# EAGLE design CAT-897-F (EAGLE 7.7.0)
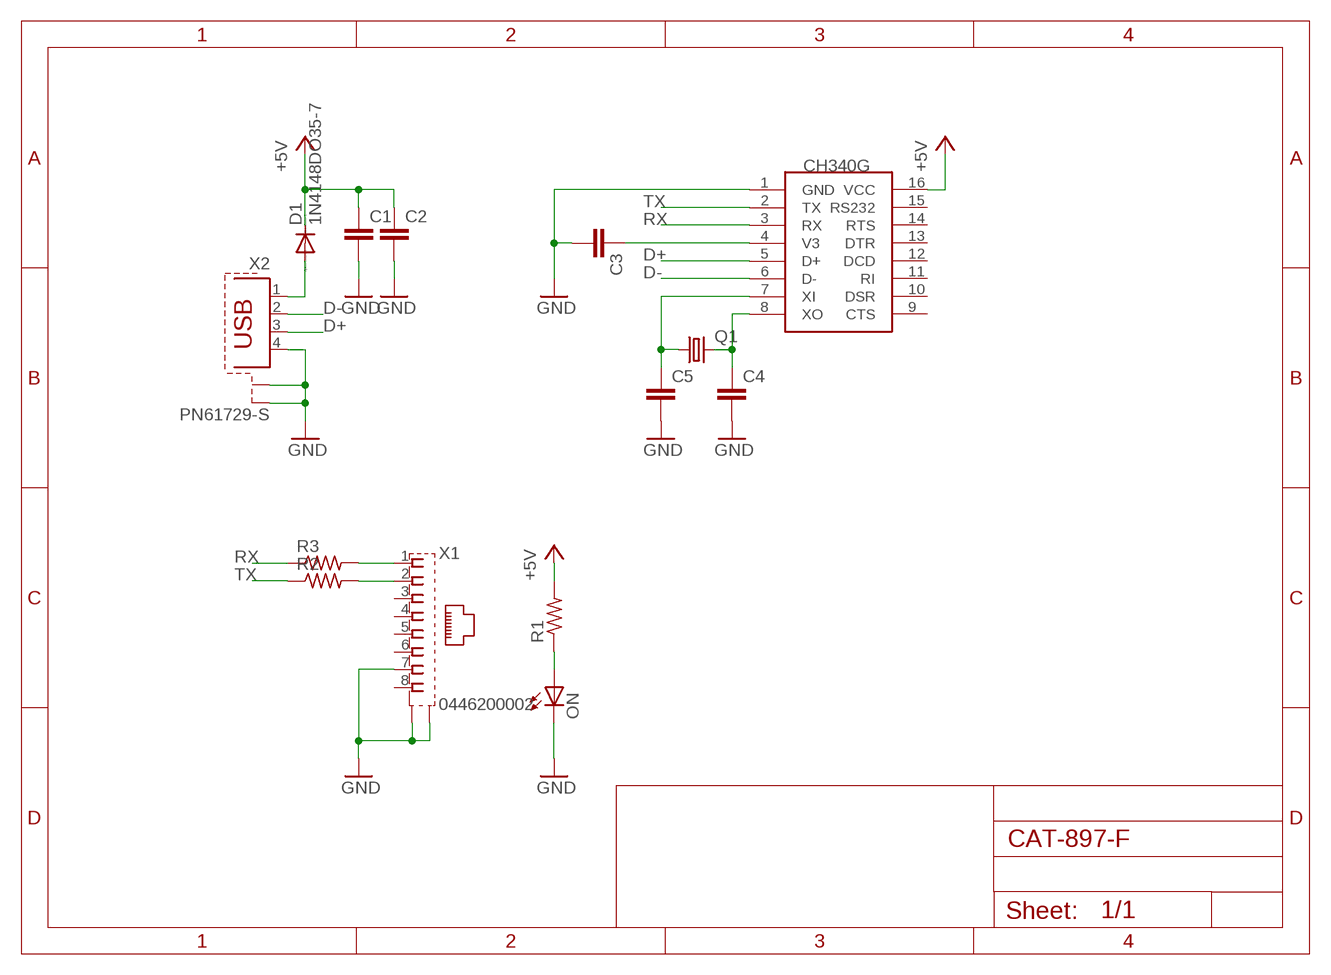
[diagram p0: schematic, sheet 1]

## Parts
C1  C-EUC0805K  [C0805K]
C2  C-EUC0805K  [C0805K]
C3  C-EUC0805K  [C0805K]
C4  C-EUC0805K  [C0805K]
C5  C-EUC0805K  [C0805K]
D1  1N4148DO35-7  [DO35-7]
ON  LED3MM  [LED3MM]
Q1  CRYSTALHC49S  [HC49/S]
R1  R-US_R0805  [R0805]
R2  R-US_M0805  [M0805]
R3  R-US_M0805  [M0805]
U$1  CH340G  [SOIC16]
X1  0446200002  [0446200002]
X2  PN61729-S  [PN61729-S]

## Nets
+5V: C1.1 C2.1 D1.C R1.2 U$1.16(VCC)
D+: U$1.5(D+) X2.3
D-: U$1.6(D-) X2.2
GND: C1.2 C2.2 C3.2 C4.2 C5.2 ON.K(C) U$1.1(GND) X1.7 X1.S@1(S1) X1.S@2(S2) X2.4 X2.S1 X2.S2
N$1: D1.A X2.1
N$2: C4.1 Q1.2 U$1.8(XO)
N$3: C5.1 Q1.1 U$1.7(XI)
N$4: C3.1 U$1.4(V3)
N$5: R2.2 X1.2
N$6: R3.2 X1.1
N$10: ON.A R1.1
RX: R3.1 U$1.3(RX)
TX: R2.1 U$1.2(TX)
Unconnected: U$1.9(CTS) U$1.10(DSR) U$1.11(RI) U$1.12(DCD) U$1.13(DTR) U$1.14(RTS) U$1.15(RS232) X1.3 X1.4 X1.5 X1.6 X1.8

## Library data of the parts
C1-C5 = rcl:C-EU: CAPACITOR, European symbol
D1 = diode:1N4148: DIODE high speed (Philips)
ON = led:LED: LED OSRAM: - CHIPLED LG R971, LG N971, LY N971, LG Q971, LY Q971, LO R971, LY R971 LH N974, LH R974 LS Q976, LO Q976, LY Q976 LO Q996 - Hyper CHIPLED LW Q18S LB Q993, LB Q99A, LB R99A - SideLED LS A670, LO A670, LY A670, LG A670, LP A670 LB A673, LV A673, LT A673, LW A673 LH A674 LY A675 LS A676, LA A676, LO A676, LY A676, LW A676 LS A679, LY A679, LG A679 - Hyper Micro SIDELED® LS Y876, LA Y876, LO Y876, LY Y876 LT Y87S - SmartLED LW L88C, LW L88S LB L89C, LB L89S, LG L890 LS L89K, LO L89K, LY L89K LS L896, LA L896, LO L896, LY L896 - TOPLED LS T670, LO T670, LY T670, LG T670, LP T670 LSG T670, LSP T670, LSY T670, LOP T670, LYG T670 LG T671, LOG T671, LSG T671 LB T673, LV T673, LT T673, LW T673 LH T674 LS T676, LA T676, LO T676, LY T676, LB T676, LH T676, LSB T676, LW T676 LB T67C, LV T67C, LT T67C, LS T67K, LO T67K, LY T67K, LW E67C LS E67B, LA E67B, LO E67B, LY E67B, LB E67C, LV E67C, LT E67C LW T67C LS T679, LY T679, LG T679 LS T770, LO T770, LY T770, LG T770, LP T770 LB T773, LV T773, LT T773, LW T773 LH T774 LS E675, LA E675, LY E675, LS T675 LS T776, LA T776, LO T776, LY T776, LB T776 LHGB T686 LT T68C, LB T68C - Hyper Mini TOPLED® LB M676 - Mini TOPLED Santana® LG M470 LS M47K, LO M47K, LY M47K Source: http://www.osram.convergy.de LUXEON: - LUMILED® LXK2-PW12-R00, LXK2-PW12-S00, LXK2-PW14-U00, LXK2-PW14-V00 LXK2-PM12-R00, LXK2-PM12-S00, LXK2-PM14-U00 LXK2-PE12-Q00, LXK2-PE12-R00, LXK2-PE12-S00, LXK2-PE14-T00, LXK2-PE14-U00 LXK2-PB12-K00, LXK2-PB12-L00, LXK2-PB12-M00, LXK2-PB14-N00, LXK2-PB14-P00, LXK2-PB14-Q00 LXK2-PR12-L00, LXK2-PR12-M00, LXK2-PR14-Q00, LXK2-PR14-R00 LXK2-PD12-Q00, LXK2-PD12-R00, LXK2-PD12-S00 LXK2-PH12-R00, LXK2-PH12-S00 LXK2-PL12-P00, LXK2-PL12-Q00, LXK2-PL12-R00 Source: www.luxeon.com KINGBRIGHT: KA-3528ASYC Source: www.kingbright.com
Q1 = crystal:CRYSTAL: CRYSTAL; OC_FARNELL: 1667008; OC_NEWARK: unknown
R1-R3 = rcl:R-US_: RESISTOR, American symbol
U$1 = ch340g:CH340G
X1 = con-molex:0446200002: RJ-45 INVERTED MODULAR JACK ASSEMBLY WITH RJ-11 KEEPOUT FEATURE Source: Data sheet <http://www.farnell.com/datasheets/73207.pdf> MOLEX 0446200002 BUCHSE, RJ45, GESCHIRMT Source: Farnell <http://de.farnell.com/molex/0446200002/buchse-rj45-geschirmt/dp/9251910?ost=9251910>; MF: MOLEX; MPN: 0446200002; OC_FARNELL: 9251910
X2 = con-berg:PN61729-S: BERG USB connector; OC_FARNELL: unknown; OC_NEWARK: unknown

## Board
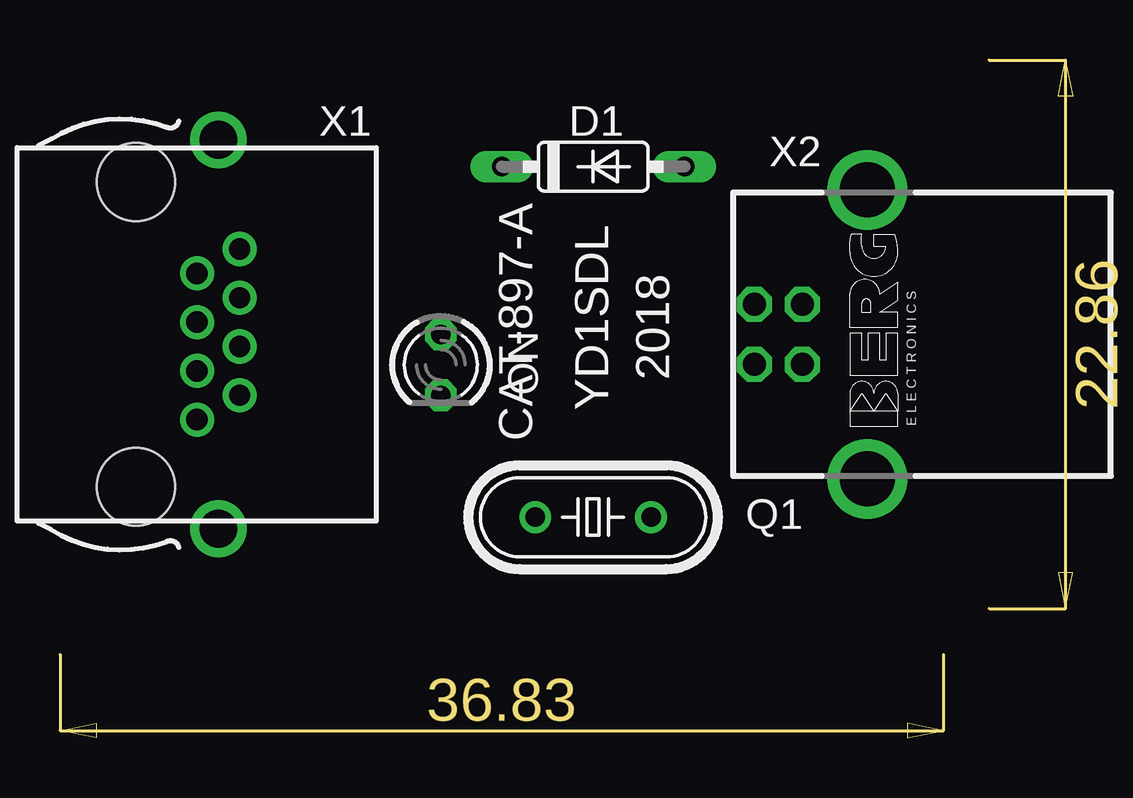
[diagram p1: board, top side]
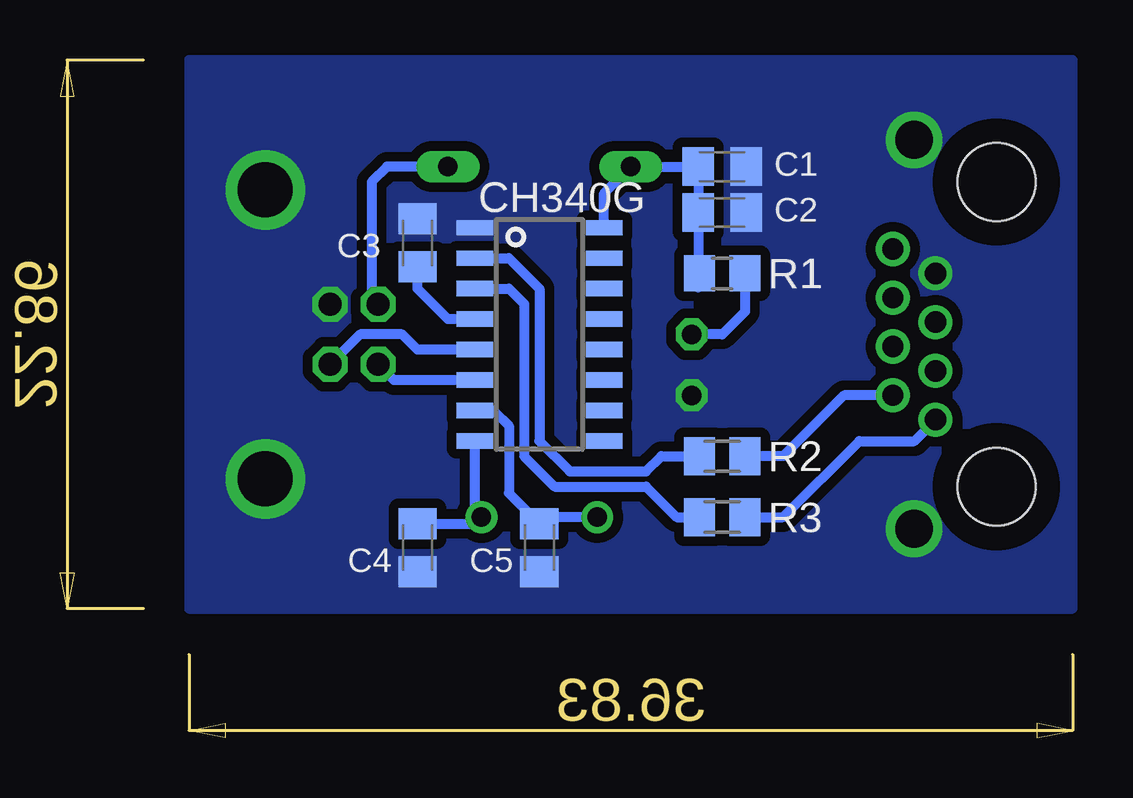
[diagram p2: board, bottom side, seen from below]

Size 42.21 x 28.24 mm. Coordinates in mm from the lower left corner, seen from the top.
Copper layers (1*16): Top 0.035mm / dielectric 1.5mm / Bottom 0.035mm
Design rules "default": minimum track width 10mil, minimum drill 24mil, track to track 8mil, track to pad 8mil, pad to pad 8mil, via to via 8mil, smd to smd 8mil, copper to edge 40mil, drill to drill 8mil, minimum pad ring 10mil, minimum via ring 8mil, stop-mask expansion 4mil, vias tented up to drill 0mil, thermal gap 10mil

### Footprints (pad centres in the part's own frame; a part is rotated, then mirrored left to right if it is on the bottom)
C0805K = smd 1.3 x 1.6: 1 -1,0; 2 1,0
DO35-7 = drill 0.813 long: A 3.81,0; C -3.81,0
LED3MM = drill 0.813 octagon: A -1.27,0; K 1.27,0
HC49/S = drill 0.813: 1 -2.413,0; 2 2.413,0
R0805 = smd 1.3 x 1.5: 1 -0.95,0; 2 0.95,0
M0805 = smd 1.3 x 1.6: 1 -0.95,0; 2 0.95,0
SOIC16 = smd 0.635 x 1.524: 1 -4.445,-2.695; 2 -3.175,-2.695; 3 -1.905,-2.695; 4 -0.635,-2.695; 5 0.635,-2.695; 6 1.905,-2.695; 7 3.175,-2.695; 8 4.445,-2.695; 9 4.445,2.695; 10 3.175,2.695; 11 1.905,2.695; 12 0.635,2.695; 13 -0.635,2.695; 14 -1.905,2.695; 15 -3.175,2.695; 16 -4.445,2.695
0446200002 = drill 0.889 pad 1.422: 1 3.556,2.54; 2 2.54,4.318; 3 1.524,2.54; 4 0.508,4.318; 5 -0.508,2.54; 6 -1.524,4.318; 7 -2.54,2.54; 8 -3.556,4.318 | drill 1.575 pad 2.286: S@1 -8.103,3.429; S@2 8.103,3.429 | hole 3.251: 6.35,0; -6.35,0
PN61729-S = drill 0.95 octagon: 1 1.25,4.71; 2 -1.25,4.71; 3 -1.25,2.71; 4 1.25,2.71 | drill 2.3 pad 2.9: S1 -6.02,0; S2 6.02,0

### Placement (x,y rotation side)
C1  14.61,23.8 0 bottom
C2  14.61,21.89 0 bottom
C3  27.3,20.62 90 bottom
C4  27.3,7.92 270 bottom
C5  22.23,7.92 270 bottom
D1  22.23,23.8 0 top
ON  15.88,15.54 270 top
Q1  22.23,9.19 0 top
R1  14.61,19.35 180 bottom
R2  14.61,11.73 0 bottom
R3  14.61,9.19 0 bottom
U$1  22.23,16.81 270 bottom
X1  3.17,16.81 270 top
X2  33.66,16.81 90 top

### Tracks (layer width: path | path; a pad name or v marks a point on that pad's centre or on a via)
+5V
  Bottom 0.406: U$1.16 19.53,22.68 D1.C C1.1 C2.1 15.61,18.77 R1.2
D+
  Bottom 0.406: U$1.5 27.3,16.17 27.94,16.81 29.7,16.81 X2.3
D-
  Bottom 0.406: U$1.6 28.29,14.9 X2.2
GND
  pour Bottom (isolate 0.406, no thermals): 36.83,5.38 0,5.38 0,28.24 36.83,28.24
N$1
  Bottom 0.406: D1.A 28.58,23.8 29.21,23.16 29.21,18.33 X2.1
N$2
  Bottom 0.406: U$1.8 24.92,9.47 Q1.2 24.91,8.92 C4.1
N$3
  Bottom 0.406: Q1.1 21.95,9.19 C5.1 23.49,10.19 23.49,13 24.13,13.63 U$1.7
N$4
  Bottom 0.406: U$1.4 26.04,17.45 27.3,18.71 C3.1
N$5
  Bottom 0.406: X1.2 9.52,14.27 12.06,11.73 R2.2
N$6
  Bottom 0.406: R3.2 12.06,9.19 8.89,12.37 6.6,12.37 X1.1
N$10
  Bottom 0.406: R1.1 13.65,17.76 14.61,16.81 ON.A
RX
  Bottom 0.406: U$1.3 23.49,18.71 22.86,18.08 22.86,11.73 21.59,10.46 17.78,10.46 16.51,9.19 R3.1
TX
  Bottom 0.406: U$1.2 23.49,19.98 22.23,18.71 22.23,12.37 20.95,11.1 17.78,11.1 17.14,11.73 R2.1

### Text on the board
tPlace: 2018 | YD1SDL | CAT-897-A